# Altium project Fotokite.PrjPcb
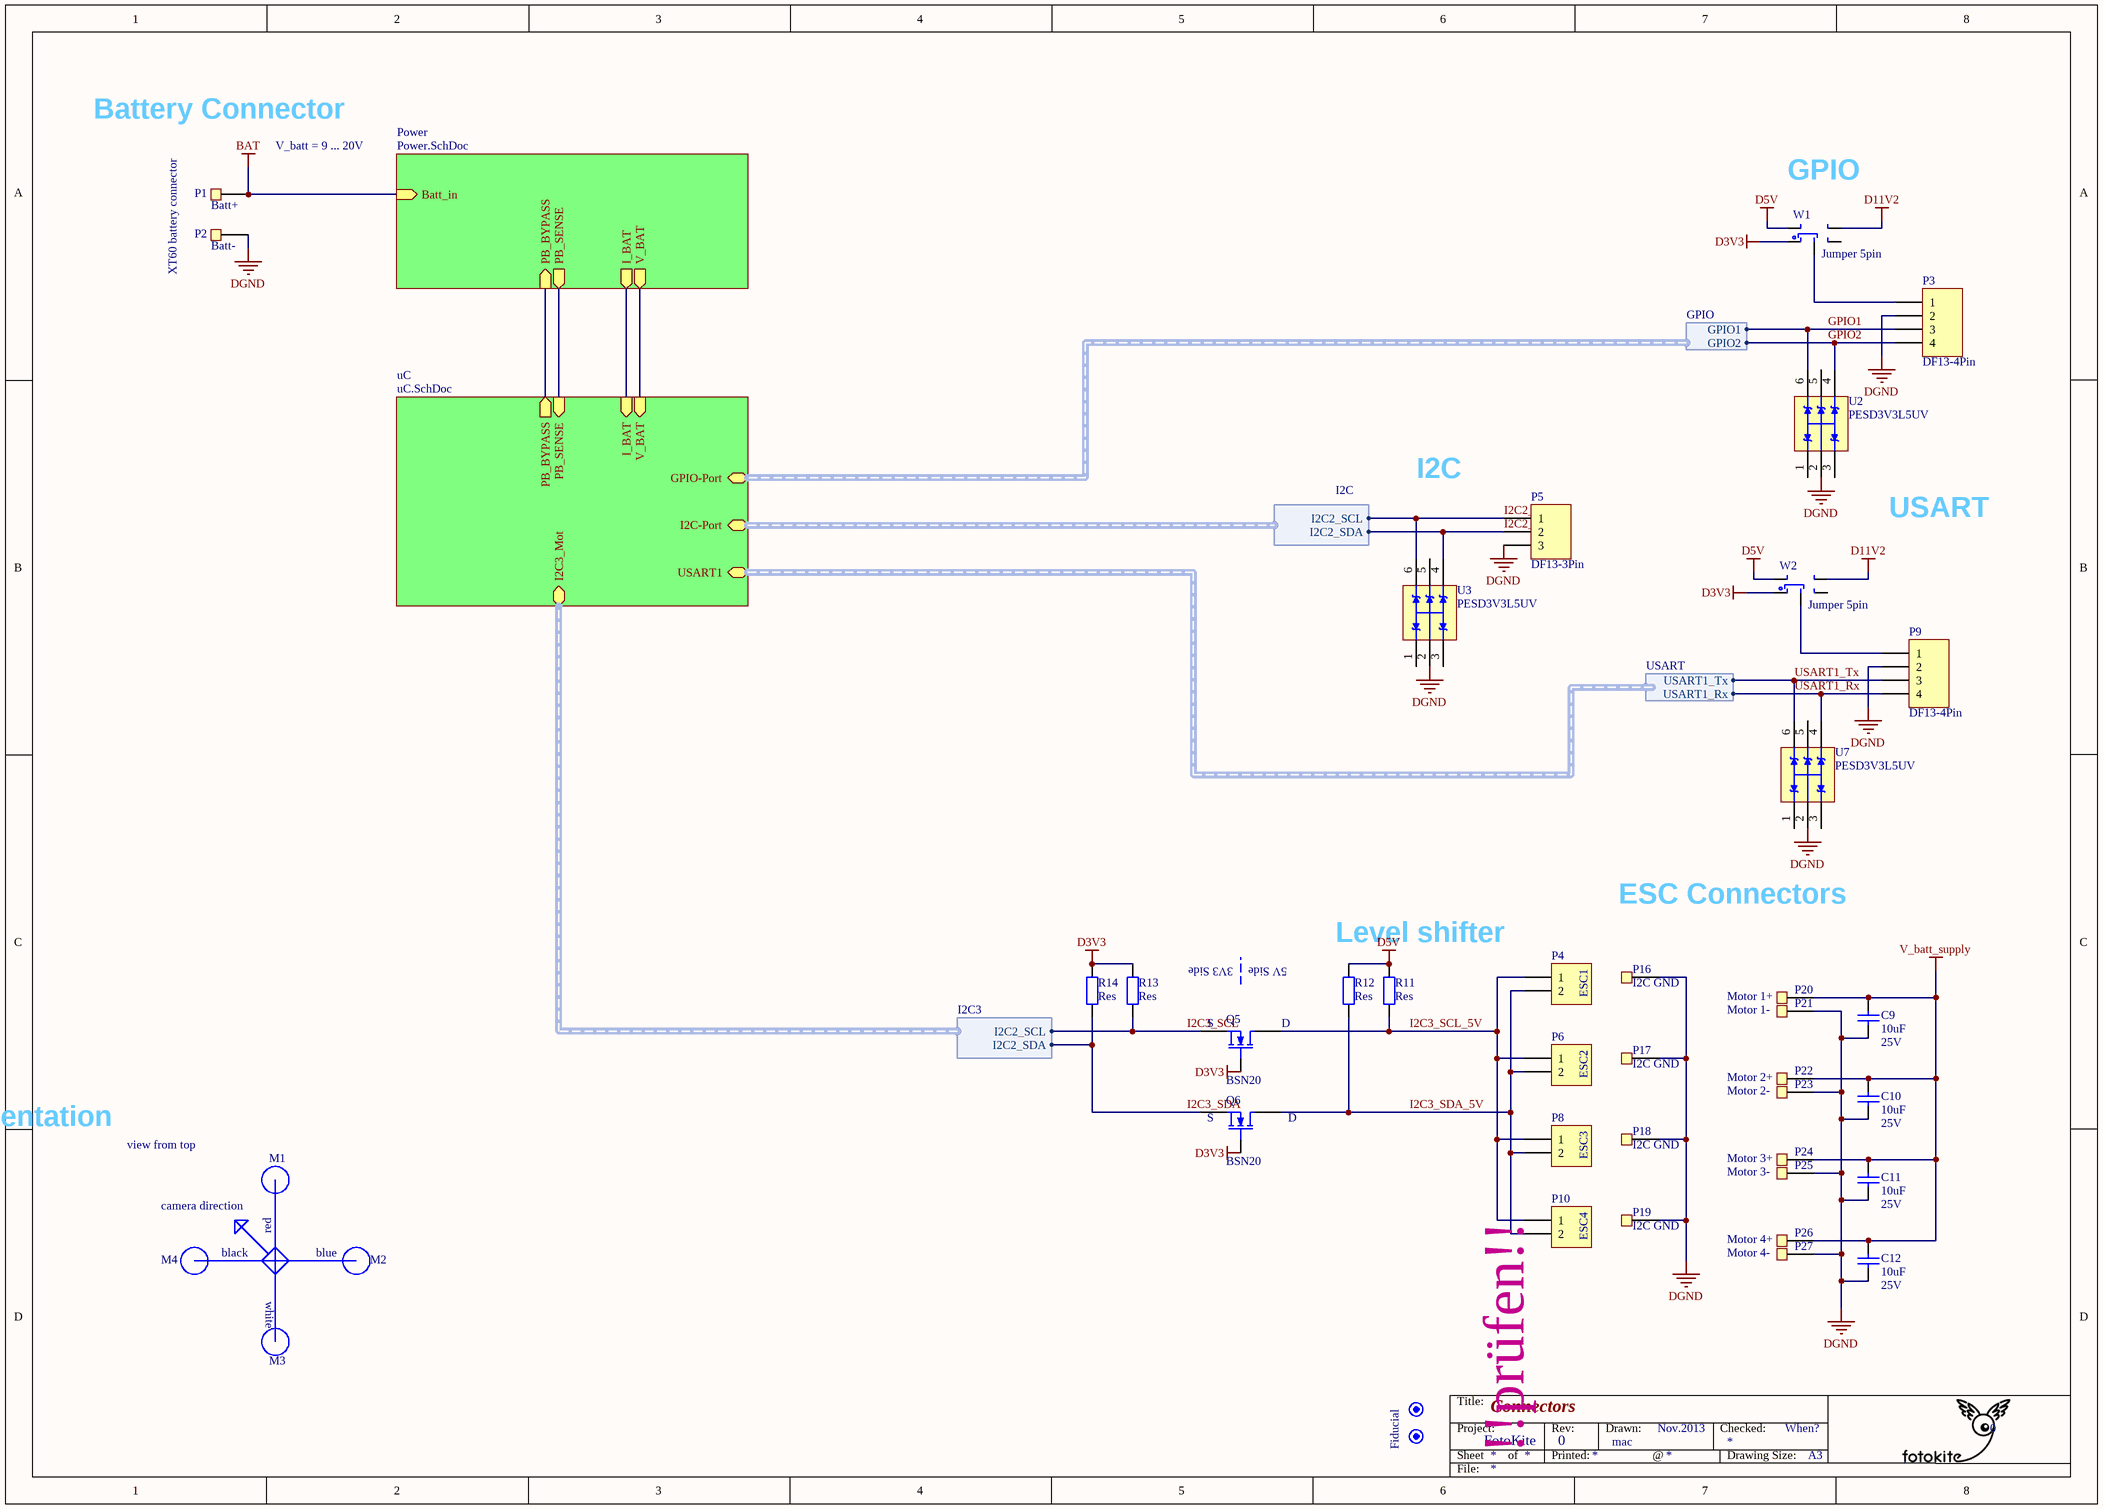
[diagram p0: Connector.SchDoc]
4 sheets, 128 parts. Net scope: hierarchical (ports join the sheet entries above them; power ports are global).
Board file: FotoKiteAdapter.PcbDoc
Sheets:
  Connector.SchDoc
    Power = Power.SchDoc
    uC = uC.SchDoc
  Ovweview.SchDoc

## Sheet Connector.SchDoc: Connectors
size A3; DrawnBy: mac; Revision: 0; Project: FotoKite; DrwanWhen: Nov.2013; CheckedWhen: When?; ProjectName: Fotokite

### Parts
C9  10uF  Note: 25V  [CAP_0805i_2012m -N]
C10  10uF  Note: 25V  [CAP_0805i_2012m -N]
C11  10uF  Note: 25V  [CAP_0805i_2012m -N]
C12  10uF  Note: 25V  [CAP_0805i_2012m -N]
FID1  Fiducial  [Fiducial 2 sides]  (value not drawn)  (no BOM)
FID2  Fiducial  [Fiducial 2 sides]  (no BOM)
P1  Batt+  [Pad_3x6mm]
P2  Batt-  [Pad_3x6mm]
P3  DF13-4Pin  [Hirose_DF13_SMT_RA_N4]
P4  ESC1  [Hirose_DF13_SMT_RA_N2]
P5  DF13-3Pin  [Hirose_DF13_SMT_RA_N3]
P6  ESC2  [Hirose_DF13_SMT_RA_N2]
P8  ESC3  [Hirose_DF13_SMT_RA_N2]
P9  DF13-4Pin  [Hirose_DF13_SMT_RA_N4]
P10  ESC4  [Hirose_DF13_SMT_RA_N2]
P16  I2C GND  [Pad_0603]
P17  I2C GND  [Pad_0603]
P18  I2C GND  [Pad_0603]
P19  I2C GND  [Pad_0603]
P20  Motor 1+  [Pad_3x4.5mm]
P21  Motor 1-  [Pad_3x4.5mm]
P22  Motor 2+  [Pad_3x4.5mm]
P23  Motor 2-  [Pad_3x4.5mm]
P24  Motor 3+  [Pad_3x4.5mm]
P25  Motor 3-  [Pad_3x4.5mm]
P26  Motor 4+  [Pad_3x4.5mm]
P27  Motor 4-  [Pad_3x4.5mm]
Q5  BSN20  [SOT23-N]
Q6  BSN20  [SOT23-N]
R11  Res  [RES_0402i_1005m -N]
R12  Res  [RES_0402i_1005m -N]
R13  Res  [RES_0402i_1005m -N]
R14  Res  [RES_0402i_1005m -N]
U2  PESD3V3L5UV  [SOT-666-N]
U3  PESD3V3L5UV  [SOT-666-N]
U7  PESD3V3L5UV  [SOT-666-N]
W1  Jumper 5pin  [J5_solder xstyle]
W2  Jumper 5pin  [J5_solder xstyle]

### Sub-sheets
Power = Power.SchDoc: Batt_in (in), I_BAT (out), PB_BYPASS (in), PB_SENSE (out), V_BAT (out)
uC = uC.SchDoc: I_BAT (in), V_BAT (in), I2C3_Mot (harness I2C3), I2C-Port (harness I2C), GPIO-Port (harness GPIO), PB_SENSE (in), PB_BYPASS (out), USART1 (harness USART)

### Harnesses
I2C3: I2C2_SCL, I2C2_SDA
I2C: I2C2_SCL, I2C2_SDA
GPIO: GPIO1, GPIO2
USART: USART1_Tx, USART1_Rx

### Nets
BAT: P1.1 ; sheet Power/Batt_in
D3V3: Q5.1(G) Q6.1(G) R13.2 R14.2 W1.1(C1) W2.1(C1)
D5V: R11.2 R12.2 W1.4(C4) W2.4(C4)
D11V2: W1.3(C3) W2.3(C3)
DGND: C9.1 C10.1 C11.1 C12.1 P2.1 P3.2 P5.3 P9.2 P16.1 P17.1 P18.1 P19.1 P21.1 P23.1 P25.1 P27.1 U2.2(a) U3.2(a) U7.2(a)
V_batt_supply: C9.2 C10.2 C11.2 C12.2 P20.1 P22.1 P24.1 P26.1
GPIO1: P3.3 U2.6(c5) ; sheet uC/GPIO-Port.GPIO1
GPIO2: P3.4 U2.4(c3) ; sheet uC/GPIO-Port.GPIO2
I2C2_SCL: P5.1 U3.6(c5) ; sheet uC/I2C-Port.I2C2_SCL
I2C2_SDA: P5.2 U3.4(c3) ; sheet uC/I2C-Port.I2C2_SDA
I2C3_SCL: Q5.2(S) R13.1 ; sheet uC/I2C3_Mot.I2C2_SCL
I2C3_SCL_5V: P4.1 P6.1 P8.1 P10.1 Q5.3(D) R11.1
I2C3_SDA: Q6.2(S) R14.1 ; sheet uC/I2C3_Mot.I2C2_SDA
I2C3_SDA_5V: P4.2 P6.2 P8.2 P10.2 Q6.3(D) R12.1
I_BAT: sheet Power/I_BAT, sheet uC/I_BAT
PB_BYPASS: sheet Power/PB_BYPASS, sheet uC/PB_BYPASS
PB_SENSE: sheet Power/PB_SENSE, sheet uC/PB_SENSE
USART1_Rx: P9.3 P9.4 U7.4(c3) U7.6(c5) ; sheet uC/USART1.USART1_Tx, sheet uC/USART1.USART1_Rx  [also labelled USART1_Tx]
V_BAT: sheet Power/V_BAT, sheet uC/V_BAT
NetP3_1: P3.1 W1.5(C5)
NetP9_1: P9.1 W2.5(C5)

Not connected (* = marked no-connect by the designer): U2 1(c1) 3(c2) 5(c4); U3 1(c1) 3(c2) 5(c4); U7 1(c1) 3(c2) 5(c4); W1 2(C2); W2 2(C2)

### Notes on the sheet
- Battery Connector
- V_batt = 9 ... 20V
- (near W1) GPIO
- XT60 battery connector
- I2C
- USART
- ESC Connectors
- 3V3 Side
- 5V Side
- Level shifter
- (near Q5) S
- (near Q5) D
- Quadrocopter orientation
- (near Q6) S
- (near Q6) D
- view from top
- M1
- camera direction
- M4
- black
- red
- blue
- M2
- !!prüfen!!
- white
- M3
- 0
- Sheet
- Project:
- Title:
- of
- Rev:
- Printed:
- Drawn:
- @
- Checked:
- Drawing Size:
- A3
- File:

### Library data of the parts
C9-C12 = Cap: capacitor; Supplier: digi-key: 587-2985-1-ND
FID1 FID2 = Fiducial: Fiducial mark for automatic pcb population; note: there is a on layer and a two layer footprint!
P1 P2 = Pad: Single Pad or Testpoint
P3 P9 = DF13-4Pin: Hirose_DF13_SMT_RA_N4
P4 P6 P8 P10 = DF13-2Pin: Hirose_DF13_SMT_RA_N2; Manufacturer ID: Hirose: DF13A-2P-1.25H(50); Supplier: digikey: H3380-ND
P5 = DF13-3Pin: Hirose_DF13_SMT_RA_N4
P16-P27 = Pad: Single Pad or Testpoint; Note: kein Bauteil
Q5 Q6 = MOSFET-N: N-Channel MOSFET; Manufacturer ID: Diodes Inc: BSN20-7; Value: BSN20; Digi-Key Part No.: BSN20-7DICT-ND; Supplier: digikey: BSN20-7DICT-ND
R11-R14 = Res: Resistor
U2 U3 U7 = PESDx: ESD-protection diode array, 5ch; Manufacturer ID: NXP:  PESD3V3L5UV; Supplier: digi-key: 568-6750-2-ND
W1 W2 = Jumper 5pin: Jumper 5-pin style

## Sheet Power.SchDoc: Power Supplies
size A3; DrawnBy: MAC; Project: FotoKite; DrwanWhen: Nov.2013; CheckedWhen: When?
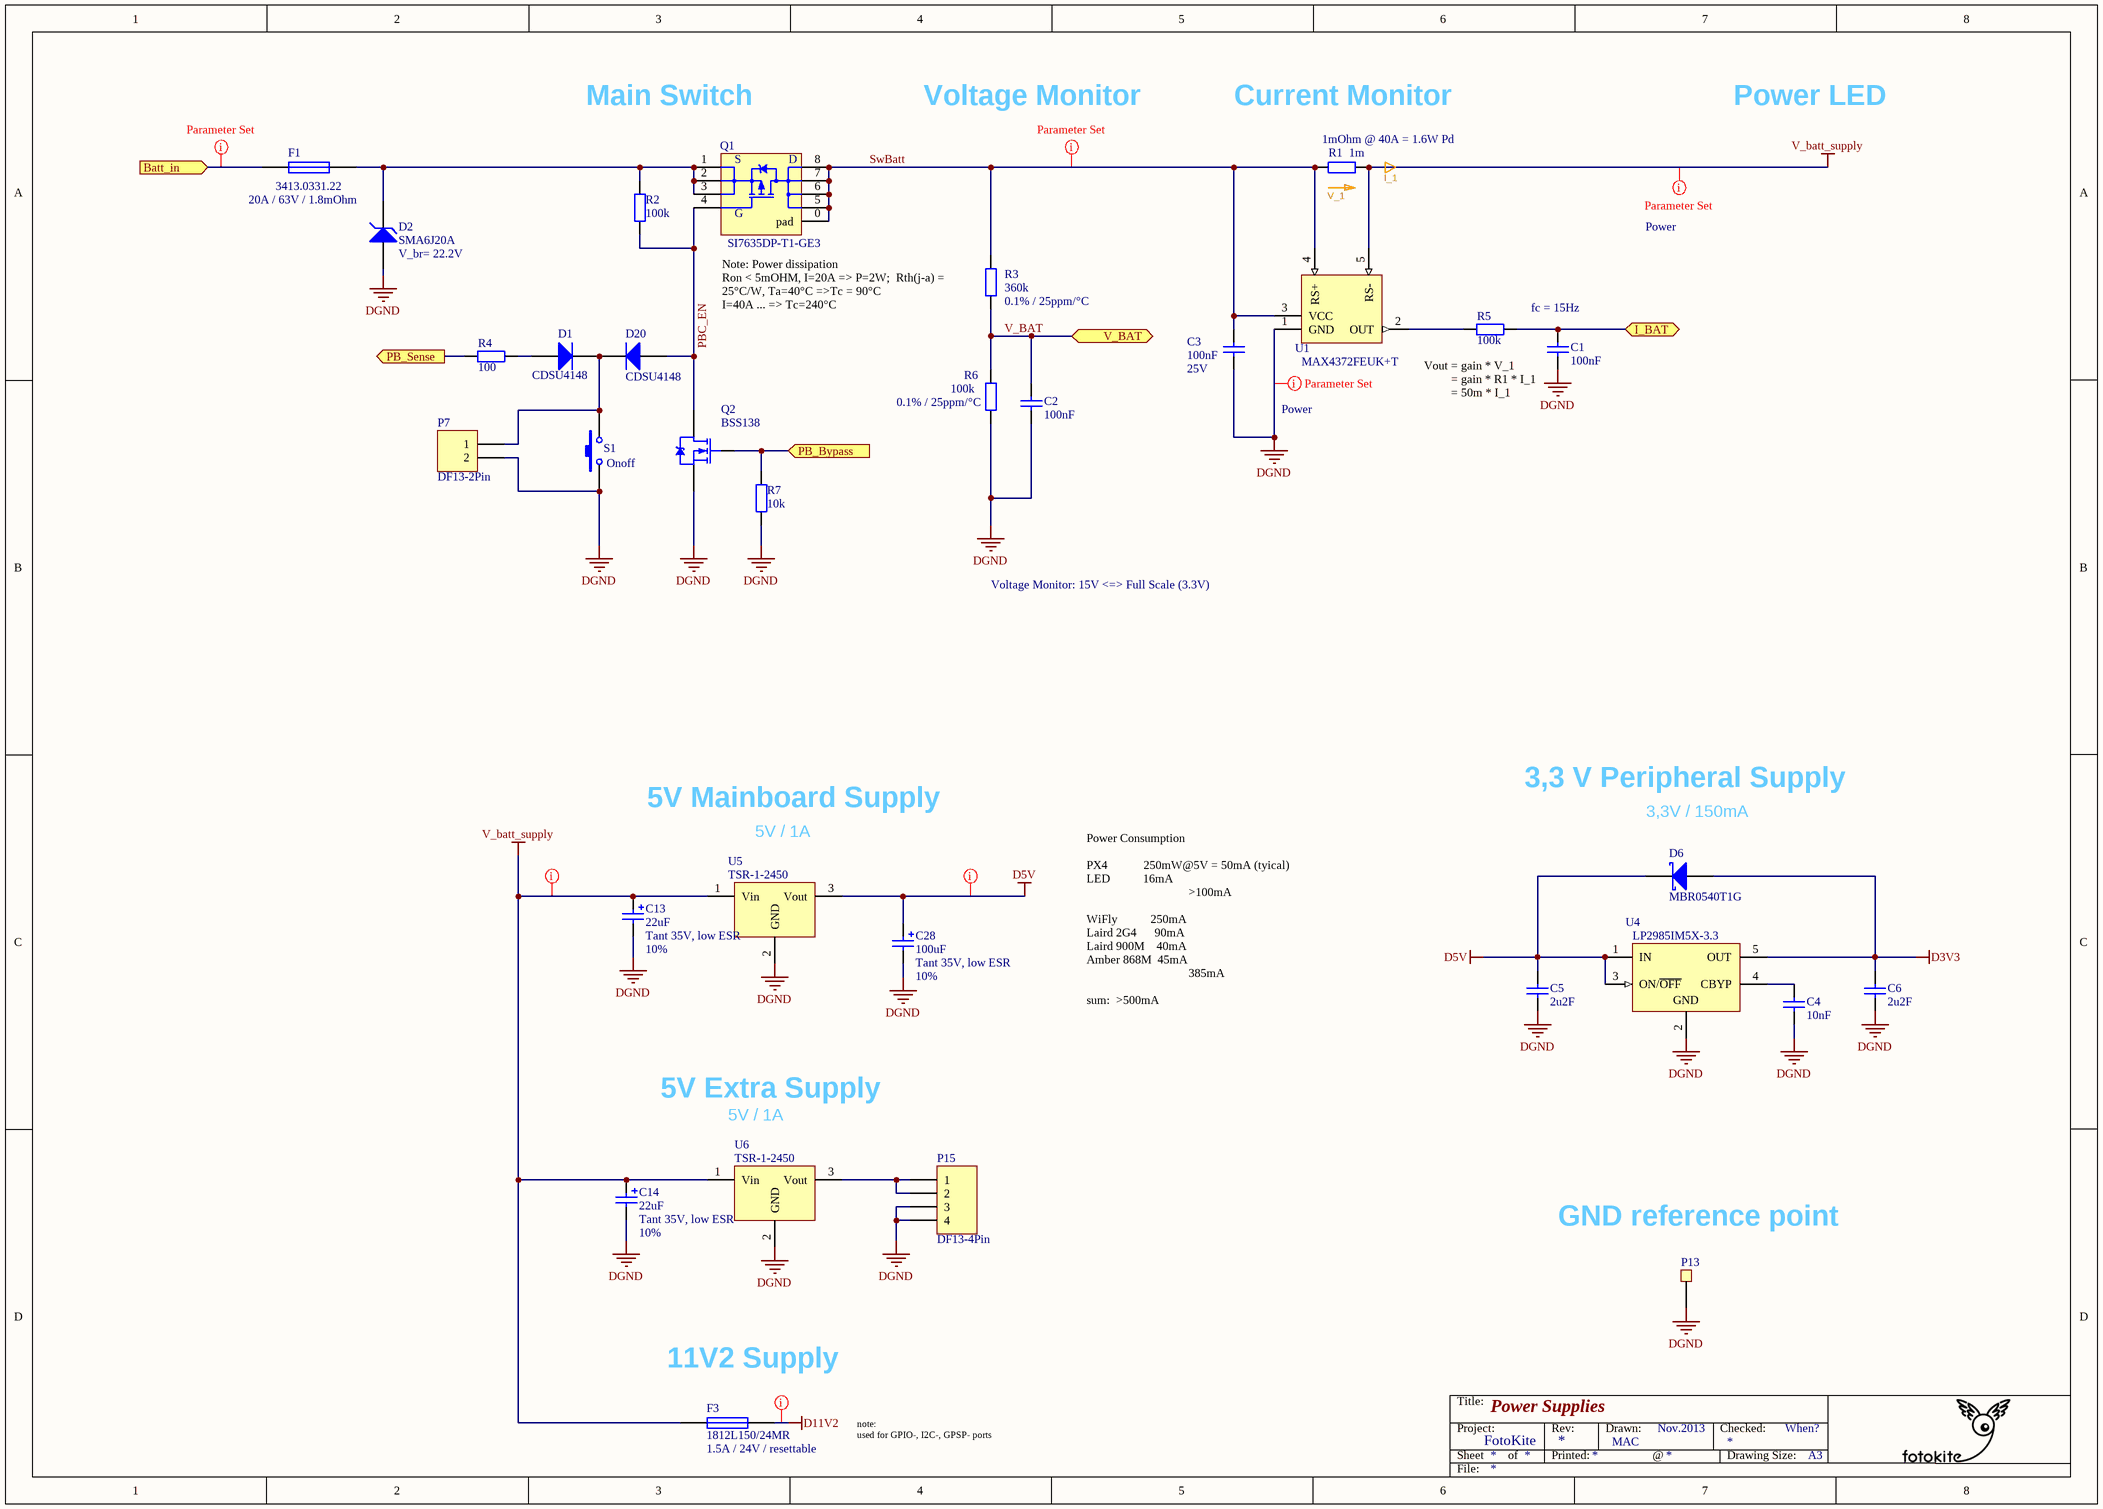
[diagram p1: Power.SchDoc]

### Parts
(Parts that share a designator on the sheet are numbered #1, #2 ... from top to bottom, then left to right.)
*#1  Note: I_1  (hidden comment: arrow_Current)  (graphical)
*#2  Note: V_1  (hidden comment: arrow_Voltage)  (graphical)
C1  100nF  [CAP_0603i_1608m -N]
C2  100nF  [CAP_0603i_1608m -N]
C3  100nF  Note: 25V  [CAP_0603i_1608m -N]
C4  10nF  [CAP_0603i_1608m -N]
C5  2u2F  [CAP_0603i_1608m -N]
C6  2u2F  [CAP_0603i_1608m -N]
C13  22uF  Note: Tant 35V, low ESR  Tolerance: 10%  [EIA-7343-31 case D -N]
C14  22uF  Note: Tant 35V, low ESR  Tolerance: 10%  [EIA-7343-31 case D -N]
C28  100uF  Note: Tant 35V, low ESR  Tolerance: 10%  [EIA-7343-31 case D -N]
D1  CDSU4148  [SOD523F]
D2  SMA6J20A  Note: V_br= 22.2V  [Mini MELF - SOD-80 -N]
D6  MBR0540T1G  [SOD123]
D20  CDSU4148  [SOD523F]
F1  3413.0331.22  Note: 20A / 63V / 1.8mOhm  [Fuse_1210i_3225m -N]
F3  1812L150/24MR  value 1.5A / 24V / resettable  [Fuse_1812i_4532m -N]
P7  DF13-2Pin  [Hirose_DF13_SMT_RA_N2]
P13  GND  [PIN1]  (value not drawn)
P15  DF13-4Pin  [Hirose_DF13_SMT_RA_N4]
Q1  SI7635DP-T1-GE3  [PowerPak SO-8]
Q2  BSS138  [SOT23-N]
R1  1m  [RES_2512i_6332m -N]
R2  100k  [RES_0603i_1608m -N]
R3  360k  Tolerance: 0.1% / 25ppm/°C  [RES_0603i_1608m -N]
R4  100  [RES_0603i_1608m -N]
R5  100k  [RES_0603i_1608m -N]
R6  100k  Tolerance: 0.1% / 25ppm/°C  [RES_0603i_1608m -N]
R7  10k  [RES_0603i_1608m -N]
S1  Note: Onoff  [EVQPU]  (hidden comment: EVQ-PUB02K)
U1  MAX4372FEUK+T  [MAXM-U5+1_N]
U4  LP2985IM5X-3.3  [MF05A_N]
U5  TSR-1-2450  [TST-1]
U6  TSR-1-2450  [TST-1]

### Ports
Batt_in (in), I_BAT, PB_Bypass, PB_Sense, V_BAT

### Nets
BAT: F1.1 ; port Batt_in
D3V3: C6.2 D6.1(A) U4.5(OUT)
D5V: C5.2 C28.1 D6.2(K) U4.1(IN) U4.3(ON/~{OFF}) U5.3(Vout)
D11V2: F3.2
DGND: C1.1 C2.1 C3.1 C4.1 C5.1 C6.1 C13.2 C14.2 C28.2 D2.1(A) P7.2 P13.1 P15.3 P15.4 Q2.2(S) R6.1 R7.1 S1.2 U1.1(GND) U4.2(GND) U5.2(GND) U6.2(GND)
V_batt_supply: C13.1 C14.1 F3.1 R1.2 U1.5(RS-) U5.1(Vin) U6.1(Vin)
I_BAT: C1.2 R5.2 ; port I_BAT
PB_BYPASS: Q2.1(G) R7.2 ; port PB_Bypass
PB_SENSE: R4.2 ; port PB_Sense
PBC_EN: D20.1(A) Q1.4(G) Q2.3(D) R2.1
SwBatt: C3.2 Q1.0(pad) Q1.5(D) Q1.6(D) Q1.7(D) Q1.8(D) R1.1 R3.2 U1.3(VCC) U1.4(RS+)
V_BAT: C2.2 R3.1 R6.2 ; port V_BAT
NetC4_2: C4.2 U4.4(CBYP)
NetD1_1: D1.1(A) R4.1
NetD1_2: D1.2(K) D20.2(K) P7.1 S1.1
NetD2_2: D2.2(K) F1.2 Q1.1(S) Q1.2(S) Q1.3(S) R2.2
NetP15_1: P15.1 P15.2 U6.3(Vout)
NetR5_1: R5.1 U1.2(OUT)

### Layout directives
net class Power: BAT, D5V, D11V2, DGND, V_batt_supply
rule Width Constraint [Pref Width = 25mil    Min Width = 10mil    Max Width = 200mil]; net class Power: SwBatt

### Notes on the sheet
- Main Switch
- Voltage Monitor
- Current Monitor
- Power LED
- 1mOhm @ 40A = 1.6W Pd
- Note: Power dissipation
  Ron < 5mOHM, I=20A => P=2W;  Rth(j-a) = 25°C/W, Ta=40°C =>Tc = 90°C
  I=40A ... => Tc=240°C
- fc = 15Hz
- (near C1) Vout = gain * V_1
  = gain * R1 * I_1
  = 50m * I_1
- Voltage Monitor: 15V <=> Full Scale (3.3V)
- 5V Mainboard Supply
- 5V / 1A
- 3,3 V Peripheral Supply
- 3,3V / 150mA
- Power Consumption
  PX4            250mW@5V = 50mA (tyical)
  LED           16mA
  >100mA
  WiFly           250mA
  Laird 2G4      90mA
  Laird 900M    40mA
  Amber 868M  45mA
  385mA
  sum:  >500mA
- 5V Extra Supply
- (near P13) GND reference point
- (near F3) 11V2 Supply
- note:
  used for GPIO-, I2C-, GPSP- ports
- Sheet
- Project:
- Title:
- of
- Rev:
- Printed:
- Drawn:
- @
- Checked:
- Drawing Size:
- A3
- File:

### Library data of the parts
C1-C6 = Cap: capacitor
C13 C14 C28 = Cap pol: Polarised capacitor (e.g. Electrolytic )
D1 D20 = Diode: Default Diode; Supplier: digikey: 641-1001-1-ND
D2 = Diode Zener: Zener Diode; Manufacturer ID: STM: SMA6J20A-TR; Supplier: digi-key: 497-5925-1-ND
D6 = Diode  Schottky: Schottky Diode; Supplier: digi-key: MBR0540T1GOSCT-ND
F1 = Fuse: Manufacturer ID: Schurter: 3413.0331.22; Supplier: digi-key; 486-1689-1-ND
F3 = Fuse: Manufacturer ID: little fuse: 1812L150/24MR; Supplier: digi-key: F3487CT-ND
P7 = DF13-2Pin: Hirose_DF13_SMT_RA_N2
P13 = Pad: Single Pad or Testpoint
P15 = DF13-4Pin: Hirose_DF13_SMT_RA_N4
Q1 = MOSFET-P-Power_2: Power P-Channel MOSFET + pad; Note: Check footprint as it may  differ; Supplier: digikey: SI7635DP-T1-GE3CT-ND
Q2 = MOSFET-N2: N-Channel MOSFET; Note: Check footprint as it may  differ; Supplier: digikey: BSS138CT-ND
R1 = Res: Resistor; Tolerance: 1%/50ppm/°C; Supplier: Digikey: CSNL20.001FRCT-ND
R2 R4 R5 R7 = Res: Resistor
R3 = Res: Resistor; Note: digikey: A103088CT-ND
R6 = Res: Resistor; Note: digikey:RG16P100KBCT-ND
S1 = SW PB: Switch; Manufacturer ID: Panasonic: EVQ-PUB02K; Supplier: digi-key: P10848SCT-ND
U1 = CMP-0252-00304-1: Micropower, Voltage-Output, High-Side, Current-Sense Amplifier, 50 V / V Gain, -40 to 85 degC, 5-Pin SOT23 (U5+1), Pb-Free, Tape and Reel; Bi-Dir. Curr. Sense: No; Gain: 20 V/V, 50 V/V ,100 V/V; ComponentLink1Description: Manufacturer URL; ComponentLink3URL: http://pdfserv.maximintegrated.com/package_dwgs/21-0057.PDF; ComponentLink2URL: http://datasheets.maximintegrated.com/en/ds/MAX4372-MAX4372T.pdf; PackageDescription: 5-Pin Small-Outline Transistor Package (U5+1), Body 2.90 x 1.625 mm, Pitch 0.95 mm; Code_JEDEC: MO178; ComponentLink1URL: http://www.maximintegrated.com/; ComponentLink3Description: Package Specification; PackageVersion: Rev. G, 04/2011; DatasheetVersion: Rev. 5; PackageReference: U5+1; Mounting Technology: Surface Mount; PartNumber: MAX4372FEUK+T; ComponentLink2Description: Datasheet; supplier: digi-key: MAX4372FEUK+TCT-ND
U4 = CMP-0062-01952-2: Micropower 150 mA Low-Noise Ultra Low-Dropout Regulator, 5-pin SOT-23; Manufacturer: National Semiconductor; CompType: LDO IC; PackageTopMarking: L0RB*XTT; PowerWise: N; DatasheetVersion: Jul-2007; RoHS: N; ComponentLink2URL: http://www.national.com/pf/LP/LP2985.html; PackageReference: MF05A; PackageVersion: revD, Aug-2008; RevisionNote: Component URLs added; PinCount: 5; ComponentLink3Description: MF05A Package Page; PackageDescription: Molded SOT-23, .115 x .063 x .040 in Body, 5 Lead, .0375 in Pitch; ComponentLink2Description: LP2985 Web Page; ComponentLink1Description: LP2985 Datasheet; ComponentLink3URL: http://www.national.com/packaging/folders/mf05a.html; ComponentLink1URL: http://www.national.com/ds/LP/LP2985.pdf; supplier: digi-key: 296-18479-1-ND
U5 U6 = TSR-1-24xx: DC/DC Converter; different Voltages; 1A; Traco

## Sheet uC.SchDoc: uC
size A3; DrawnBy: MAC; Revision: 0; Project: FotoKite; DrwanWhen: Nov.2013; CheckedWhen: When?
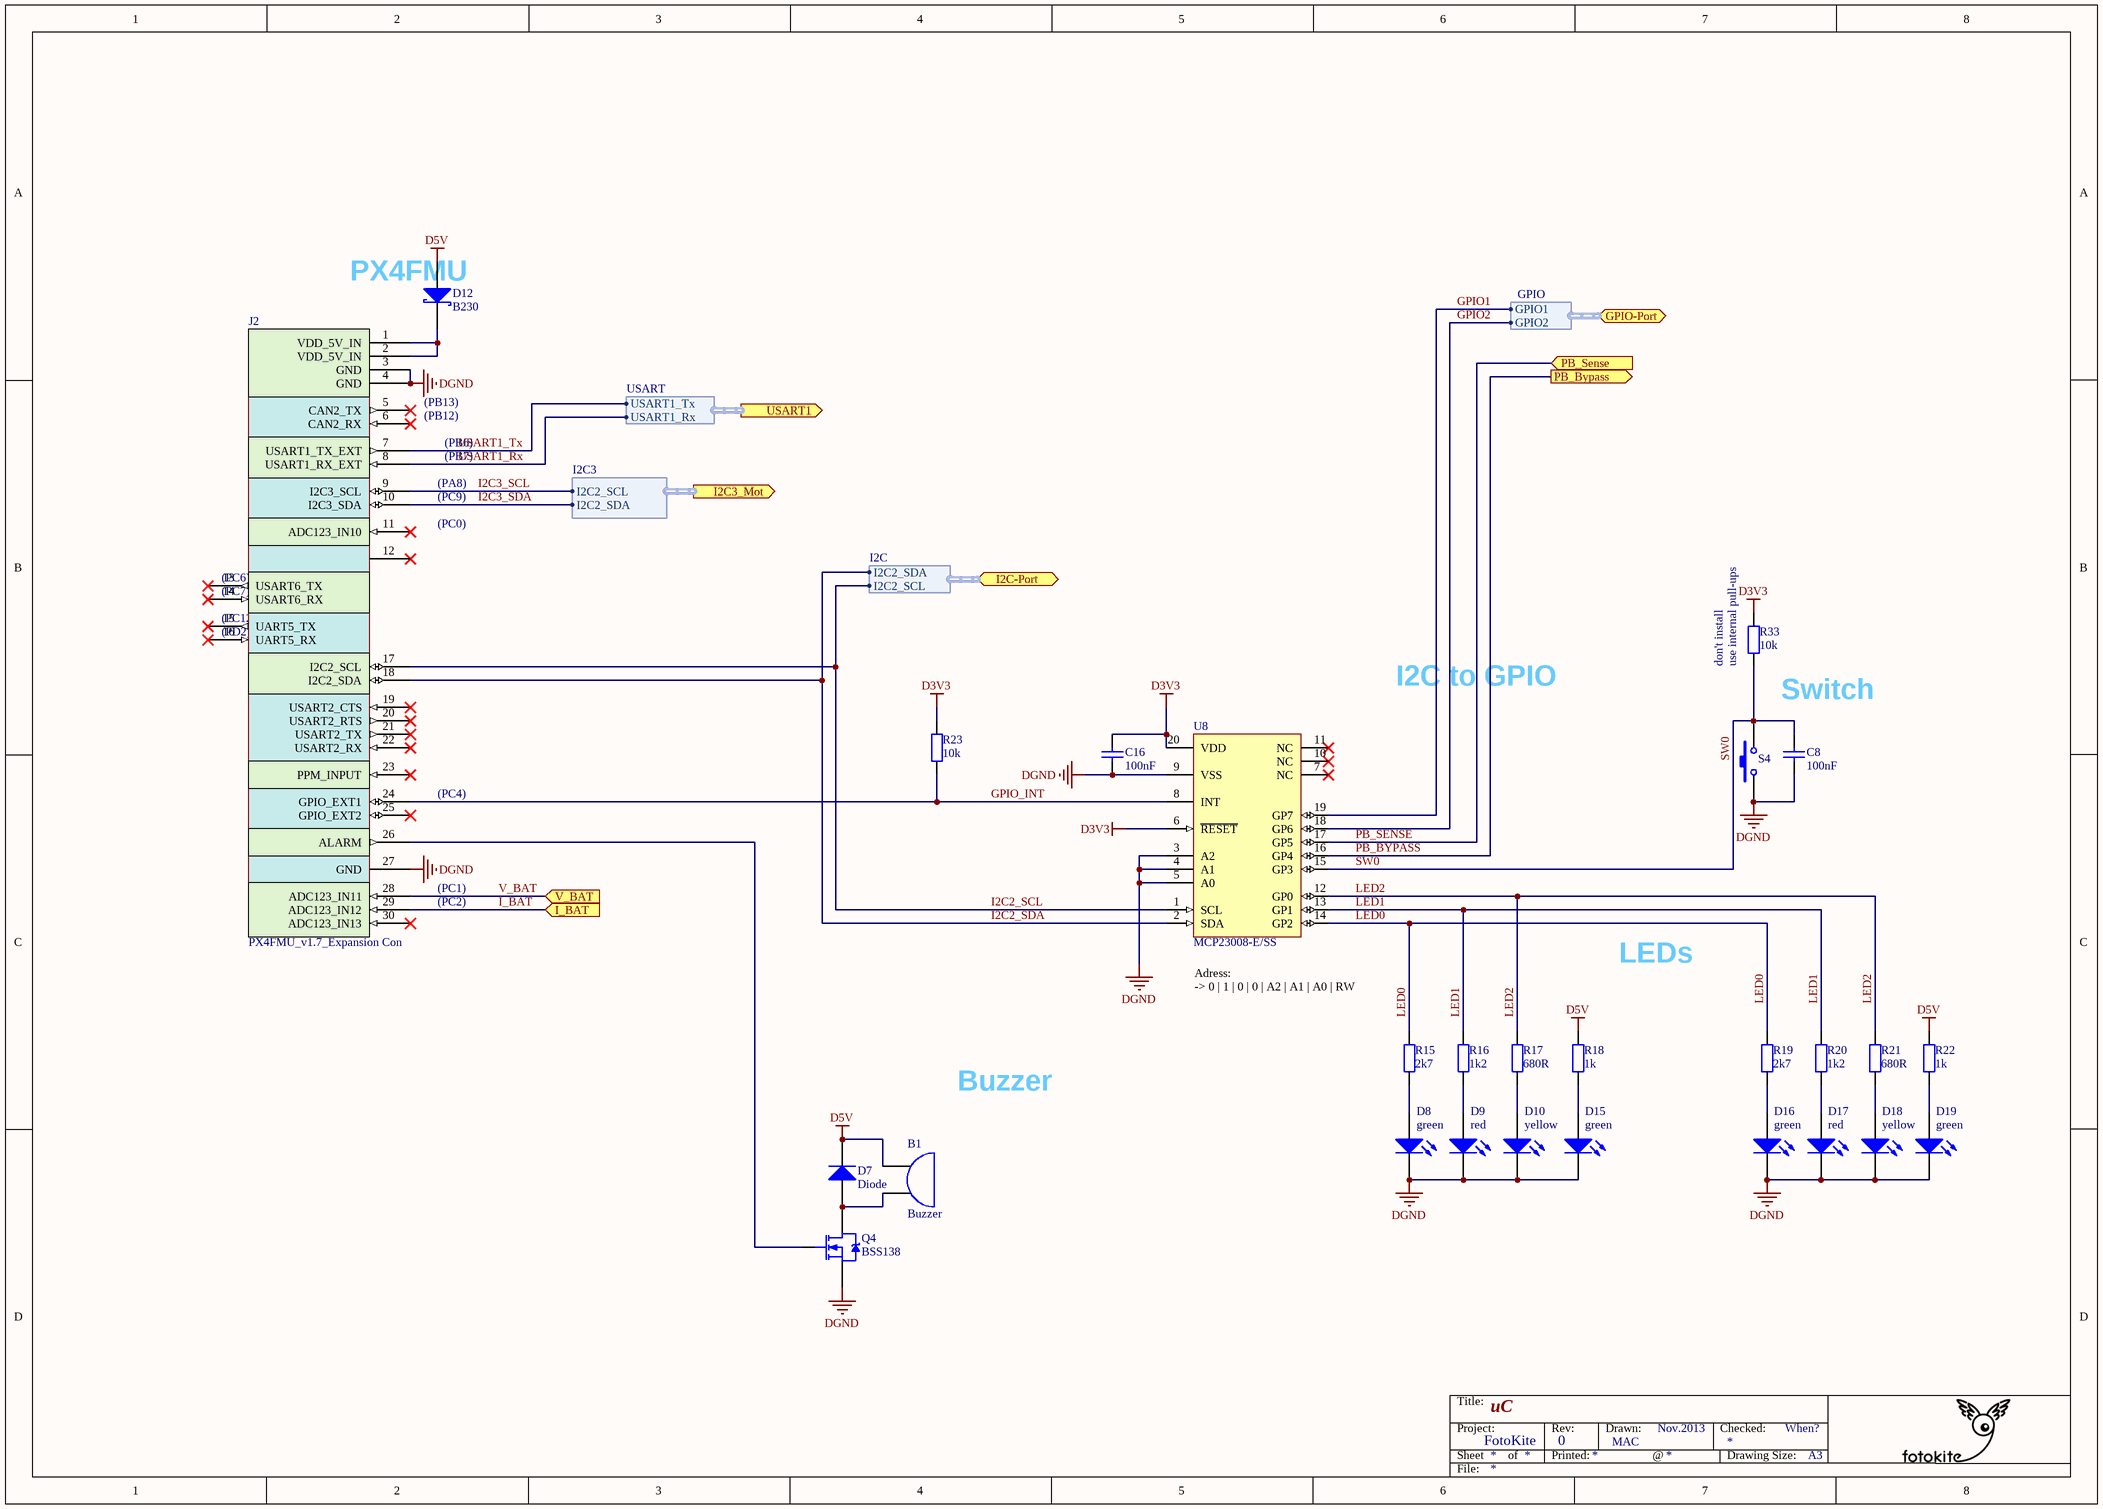
[diagram p2: uC.SchDoc]

### Parts
B1  Buzzer  [Buzzer_SMT-0827-SW-3V-R]
C8  100nF  [CAP_0603i_1608m -N]
C16  100nF  [CAP_0603i_1608m -N]
D7  Diode  [Mini MELF - SOD-80 -N]
D8  Colour: green  [LED_LTST_SIDE]  (hidden comment: Diode LED green)
D9  Colour: red  [LED_LTST_SIDE]  (hidden comment: Diode LED red)
D10  Colour: yellow  [LED_LTST_SIDE]  (hidden comment: Diode LED yellow)
D12  B230  [Diode SMB DO-214aa -N]
D15  Colour: green  [LED_LTST_SIDE]  (hidden comment: Diode LED green)
D16  Colour: green  [LED_LTST_SIDE]  (hidden comment: Diode LED green)
D17  Colour: red  [LED_LTST_SIDE]  (hidden comment: Diode LED red)
D18  Colour: yellow  [LED_LTST_SIDE]  (hidden comment: Diode LED yellow)
D19  Colour: green  [LED_LTST_SIDE]  (hidden comment: Diode LED green)
J2  PX4FMU_v1.7_Expansion Con  [PX4FMU_v1.7_module_sicket]
Q4  BSS138  [SOT23-N]
R15  2k7  [RES_0603i_1608m -N]
R16  1k2  [RES_0603i_1608m -N]
R17  680R  [RES_0603i_1608m -N]
R18  1k  [RES_0603i_1608m -N]
R19  2k7  [RES_0603i_1608m -N]
R20  1k2  [RES_0603i_1608m -N]
R21  680R  [RES_0603i_1608m -N]
R22  1k  [RES_0603i_1608m -N]
R23  10k  [RES_0603i_1608m -N]
R33  10k  Note: don't install  Note2: use internal pull-ups  [RES_0603i_1608m -N]
S4  EVQ-PUB02K  [EVQPU]  (value not drawn)
U8  MCP23008-E/SS  [SSOP-SS20_N]

### Ports
GPIO-Port (harness GPIO), I2C3_Mot (harness I2C3), I2C-Port (harness I2C), I_BAT (in), PB_Bypass (out), PB_Sense, USART1 (harness USART), V_BAT (in)

### Harnesses
I2C3: I2C2_SCL, I2C2_SDA
GPIO: GPIO1, GPIO2
I2C: I2C2_SCL, I2C2_SDA
USART: USART1_Tx, USART1_Rx

### Nets
D3V3: C16.1 R23.2 R33.2 U8.6(~{RESET}) U8.20(VDD)
D5V: B1.1 D7.2(K) D12.1(A) R18.2 R22.2
DGND: C8.1 C16.2 D8.2(K) D9.2(K) D10.2(K) D15.2(K) D16.2(K) D17.2(K) D18.2(K) D19.2(K) J2.3(GND) J2.4(GND) J2.27(GND) Q4.2(S) S4.2 U8.3(A2) U8.4(A1) U8.5(A0) U8.9(VSS)
GPIO1: U8.19(GP7) ; port GPIO-Port.GPIO1
GPIO2: U8.18(GP6) ; port GPIO-Port.GPIO2
GPIO_INT: J2.24(GPIO_EXT1) R23.1 U8.8(INT)
I2C2_SCL: J2.17(I2C2_SCL) U8.1(SCL) ; port I2C-Port.I2C2_SCL
I2C2_SDA: J2.18(I2C2_SDA) U8.2(SDA) ; port I2C-Port.I2C2_SDA
I2C3_SCL: J2.9(I2C3_SCL) ; port I2C3_Mot.I2C2_SCL
I2C3_SDA: J2.10(I2C3_SDA) ; port I2C3_Mot.I2C2_SDA
I_BAT: J2.29(ADC123_IN12) ; port I_BAT
LED0: R15.2 R19.2 U8.14(GP2)
LED1: R16.2 R20.2 U8.13(GP1)
LED2: R17.2 R21.2 U8.12(GP0)
PB_BYPASS: U8.16(GP4) ; port PB_Bypass
PB_SENSE: U8.17(GP5) ; port PB_Sense
SW0: C8.2 R33.1 S4.1 U8.15(GP3)
USART1_Rx: J2.7(USART1_TX_EXT) J2.8(USART1_RX_EXT) ; port USART1.USART1_Tx, port USART1.USART1_Rx  [also labelled USART1_Tx]
V_BAT: J2.28(ADC123_IN11) ; port V_BAT
NetB1_2: B1.2 D7.1(A) Q4.3(D)
NetD8_1: D8.1(A) R15.1
NetD9_1: D9.1(A) R16.1
NetD10_1: D10.1(A) R17.1
NetD12_2: D12.2(K) J2.1(VDD_5V_IN) J2.2(VDD_5V_IN)
NetD15_1: D15.1(A) R18.1
NetD16_1: D16.1(A) R19.1
NetD17_1: D17.1(A) R20.1
NetD18_1: D18.1(A) R21.1
NetD19_1: D19.1(A) R22.1
NetJ2_26: J2.26(ALARM) Q4.1(G)

Not connected (* = marked no-connect by the designer): J2 5(CAN2_TX)* 6(CAN2_RX)* 11(ADC123_IN10)* 12* 13(USART6_TX)* 14(USART6_RX)* 15(UART5_TX)* 16(UART5_RX)* 19(USART2_CTS)* 20(USART2_RTS)* 21(USART2_TX)* 22(USART2_RX)* 23(PPM_INPUT)* 25(GPIO_EXT2)* 30(ADC123_IN13)*; U8 7(NC)* 10(NC)* 11(NC)*

### Notes on the sheet
- PX4FMU
- (near J2) (PB13)
- (near J2) (PB12)
- (near J2) (PB6)
- (near J2) (PA8)
- (near J2) (PC9)
- (near J2) (PB7)
- (near J2) (PC6)
- (near J2) (PC0)
- (near J2) (PC7)
- (near J2) (PC12)
- (near J2) (PD2)
- I2C to GPIO
- Switch
- (near J2) (PC4)
- (near J2) (PC1)
- (near J2) (PC2)
- LEDs
- Adress:
  -> 0 | 1 | 0 | 0 | A2 | A1 | A0 | RW
- Buzzer
- Sheet
- Project:
- Title:
- of
- Rev:
- Printed:
- Drawn:
- @
- Checked:
- Drawing Size:
- A3
- File:

### Library data of the parts
B1 = Buzzer: Generic Buzzer; Manufacturer ID: SMT-0827-SW-3V-R; Supplier: digikey: 668-1193-1-ND
C8 C16 = Cap: capacitor
D7 = Diode: Default Diode
D8 D15 D16 D19 = Diode LED: LED; Note: 1V7 / 2mA; Supplier: Digikey: 160-1478-1-ND
D9 D17 = Diode LED: LED; note: 1V8 / 2mA; Supplier: Digikey: 160-1479-1-ND
D10 D18 = Diode LED: LED; Note: 1V8 / 2mA; Supplier: Digikey: 160-1480-1-ND
D12 = Diode  Schottky: Schottky Diode; Manufacturer ID: Diodes Inc: B230-13-F; Note: Alternative: SS24/1; Supplier: digi-key: B230-FDICT-ND
J2 = PX4FMU_v1.7_Expansion Con_1: J2 / J3; Supplier: digikey: 3M9197CT-ND
Q4 = MOSFET-N2: as Q2 on sheet Power; Supplier: digikey: BSS138-FDICT-ND; price (1) €: 0.29; price (100) €: 0.1469
R15-R23 R33 = Res: Resistor
S4 = SW PB: as S1 on sheet Power; Supplier: digi-key: P10848SCT-ND
U8 = CMP-0186-00169-3: 8-Bit I/O Expander with Serial Interface, 20-Pin SSOP, Extended Temperature; PackageVersion: revBB, Aug-2009; Code_JEDEC: MO-150; ComponentLink3URL: http://www.microchip.com/stellent/groups/techpub_sg/documents/packagingspec/en012702.pdf; PackageReference: SSOP-SS20; ComponentLink2Description: Datasheet; ComponentLink1URL: http://www.microchip.com/; ComponentLink2URL: http://ww1.microchip.com/downloads/en/DeviceDoc/21919e.pdf; RevisionNote: Sch corrected.; PackageDescription: 20-Lead Plastic Shrink Small Outline (SS) - 5.3mm Body [SSOP]; ComponentLink1Description: Manufacturer URL; ComponentLink3Description: Package Specification; DatasheetVersion: revE, Aug-2007

## Sheet Ovweview.SchDoc
size A3; Project: Project?; DrwanWhen: When?; CheckedWhen: When?
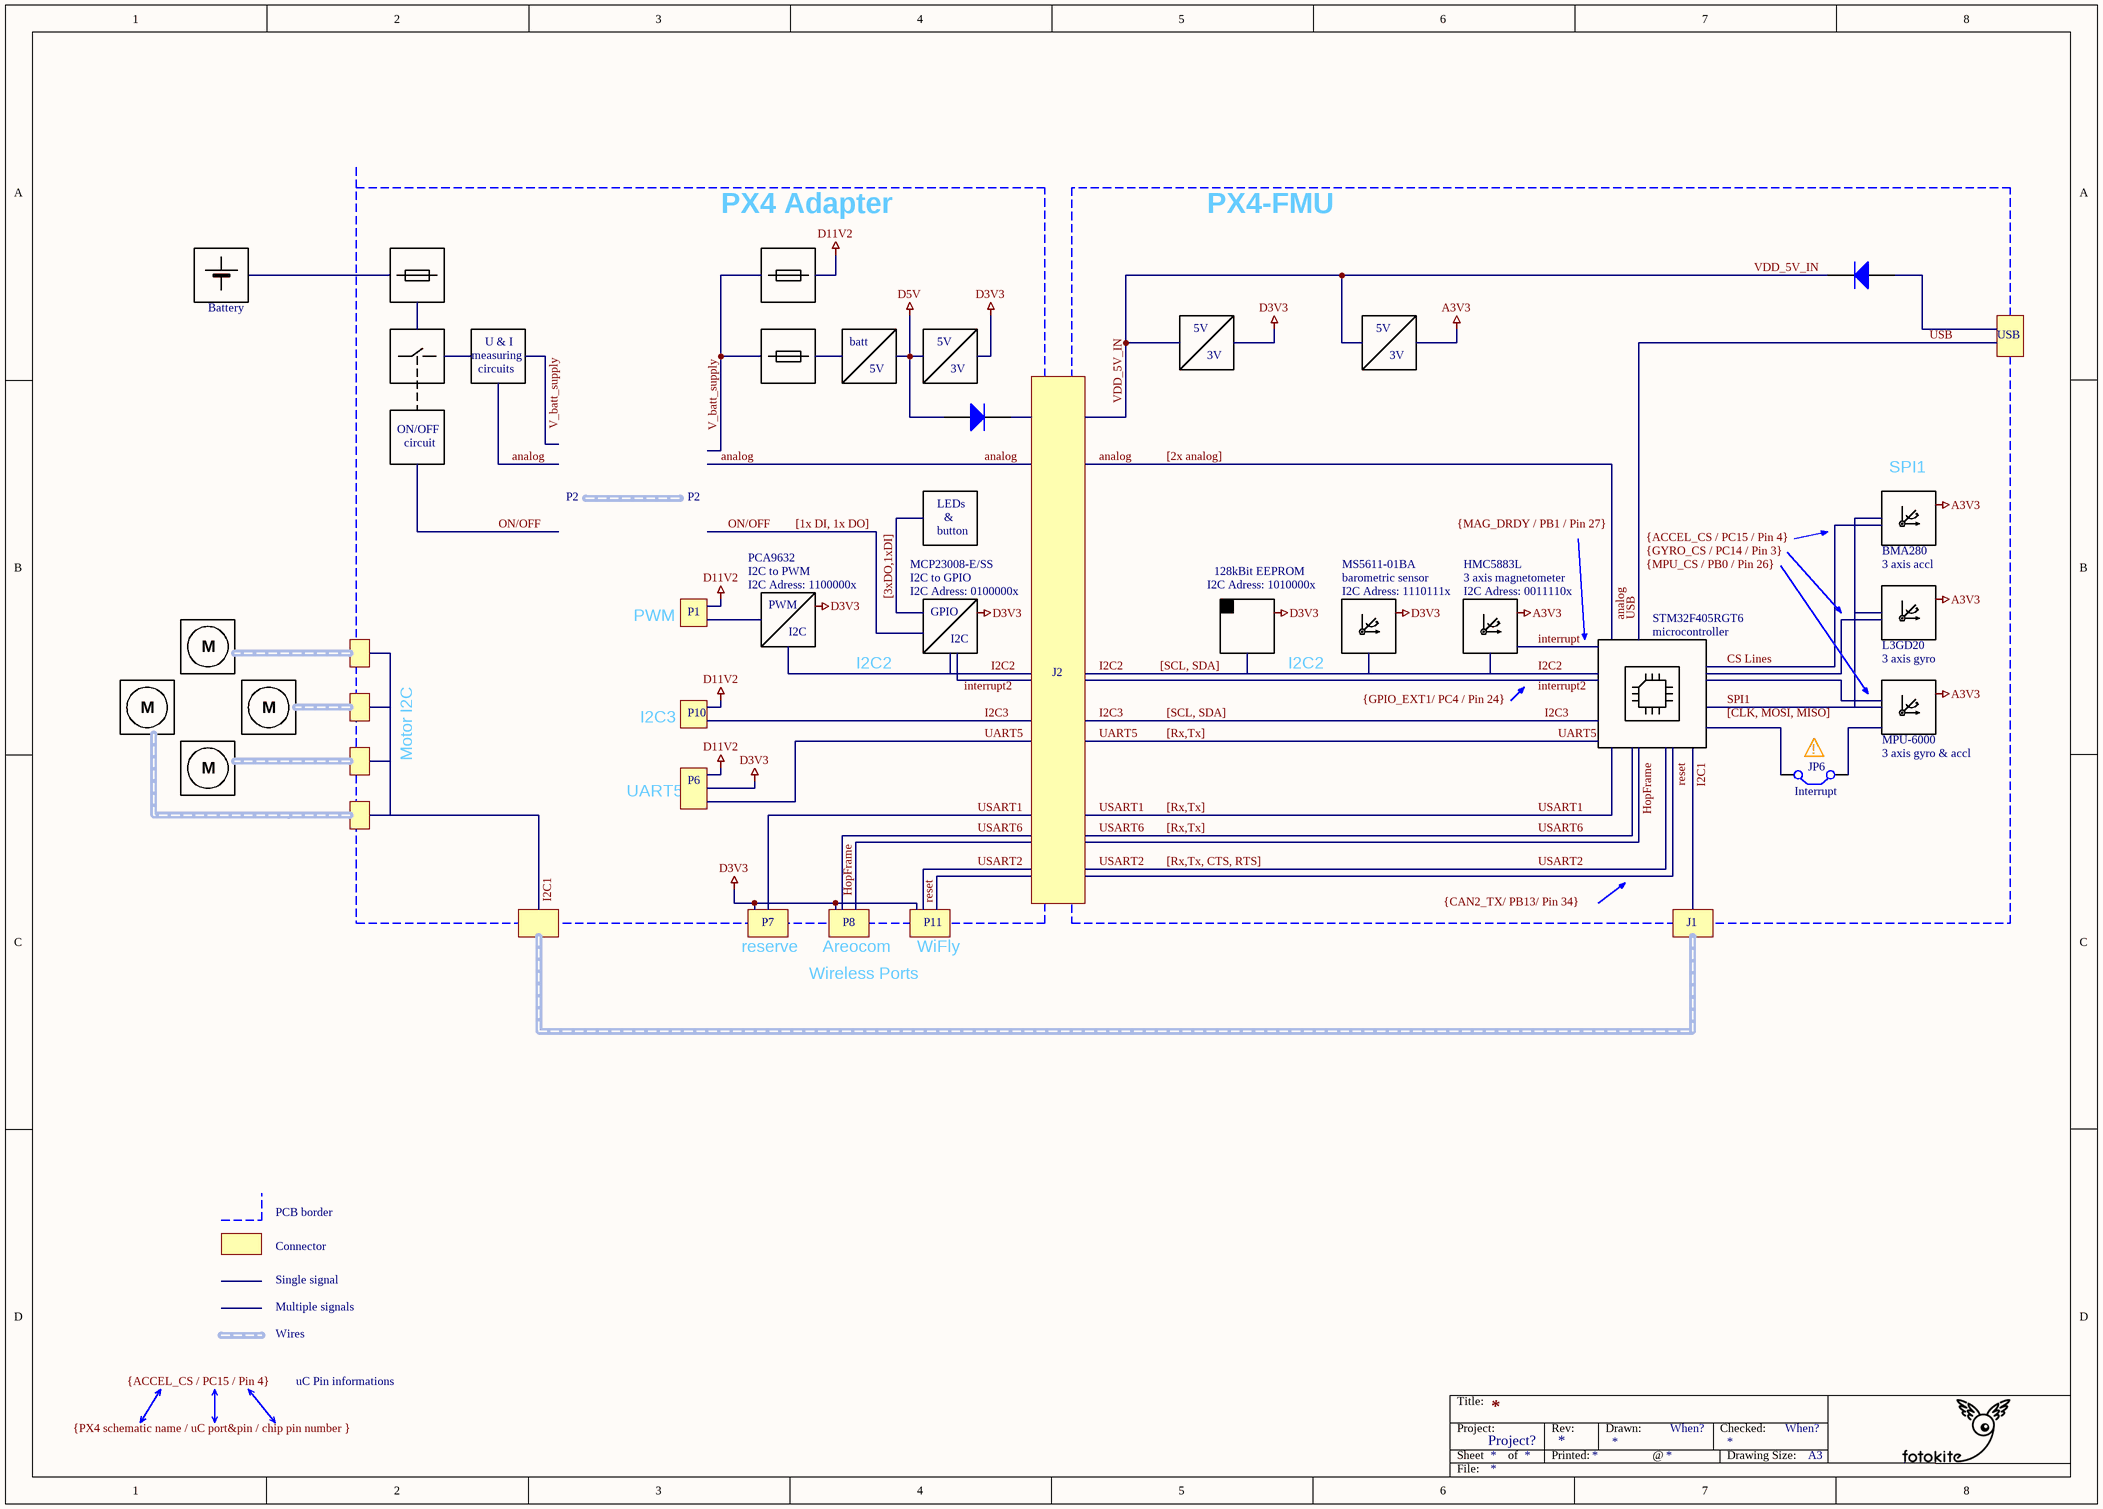
[diagram p3: Ovweview.SchDoc]

### Parts
(Parts that share a designator on the sheet are numbered #1, #2 ... from top to bottom, then left to right.)
128kBit_EEPROM  I2C Adress: 1010000x  (hidden comment: block_empty)  (graphical)
*#3  block_Fuse  (value not drawn)  (graphical)
*#4  block_Fuse  (value not drawn)  (graphical)
*#5  block_Transformer  (value not drawn)  (graphical)
*#6  block_Transformer  (value not drawn)  (graphical)
*#7  block_switch  (value not drawn)  (graphical)
*#8  Note: U & I  (hidden comment: block_empty)  (graphical)
*#9  block_Fuse  (value not drawn)  (graphical)
*#10  block_Transformer  (value not drawn)  (graphical)
*#11  block_Transformer  (value not drawn)  (graphical)
*#12  block_empty  (value not drawn)  (graphical)
*#13  block_empty  (value not drawn)  (graphical)
*#14  block_motor  (value not drawn)  (graphical)
*#15  block_motor  (value not drawn)  (graphical)
*#16  block_motor  (value not drawn)  (graphical)
*#17  sign_attention  (value not drawn)  (graphical)
*#18  block_motor  (value not drawn)  (graphical)
Battery  block_battery  (value not drawn)  (graphical)
BMA280  Note: 3 axis accl  (hidden comment: block_IMU)  (graphical)
D13  Diode  [Mini MELF - SOD-80 -N]  (value not drawn)
D14  Diode  [Mini MELF - SOD-80 -N]  (value not drawn)
HMC5883L  Note: 3 axis magnetometer  I2C Adress: 0011110x  (hidden comment: block_IMU)  (graphical)
JP6  Interrupt  [RES_0603i_1608m -N]
L3GD20  Note: 3 axis gyro  (hidden comment: block_IMU)  (graphical)
MCP23008-E/SS  Note: I2C to GPIO  I2C Adress: 0100000x  (hidden comment: block_Transformer)  (graphical)
MPU-6000  Note: 3 axis gyro & accl  (hidden comment: block_IMU)  (graphical)
MS5611-01BA  Note: barometric sensor  I2C Adress: 1110111x  (hidden comment: block_IMU)  (graphical)
PCA9632  Note: I2C to PWM  I2C Adress: 1100000x  (hidden comment: block_Transformer)  (graphical)
STM32F405RGT6  Note: microcontroller  (hidden comment: block_uC)  (graphical)

### Blocks framed on the sheet
PX4-FMU: 128kBit_EEPROM *#5 *#6 *#17 BMA280 D13 HMC5883L JP6 L3GD20 MPU-6000 MS5611-01BA STM32F405RGT6

### Nets
D5V: D14.1(A)
VDD_5V_IN: D13.2(K)

Not connected (* = marked no-connect by the designer): D13 1(A); D14 2(K); JP6 1(C1) 2(C2)

### Buses and harness runs
bus [1x DI, 1x DO] = ON/OFF
bus [2x analog] = analog
bus [3xDO,1xDI]
bus [Rx,Tx, CTS, RTS] = USART2
bus [Rx,Tx] = UART5
bus [Rx,Tx] = USART1
bus [Rx,Tx] = USART6
bus [SCL, SDA] = I2C2
bus [SCL, SDA] = I2C3
bus analog
bus I2C1
bus ON/OFF
bus SPI1
bus USB

### Notes on the sheet
- PX4 Adapter
- USB
- P2
- SPI1
- PWM
- P1
- I2C3
- P10
- (near MCP23008-E/SS) I2C2
- J2
- (near MS5611-01BA) I2C2
- Motor I2C
- P6
- UART5
- reserve
- P7
- Wireless Ports
- Areocom
- P8
- WiFly
- P11
- J1
- Connector
- PCB border
- Single signal
- Multiple signals
- Wires
- uC Pin informations
- Labels drawn without touching a wire or pin: [CLK, MOSI, MISO], A3V3, D3V3, interrupt2, {ACCEL_CS / PC15 / Pin 4}, {CAN2_TX/ PB13/ Pin 34}, {GPIO_EXT1/ PC4 / Pin 24}, {GYRO_CS / PC14 / Pin 3}, {MAG_DRDY / PB1 / Pin 27}, {MPU_CS / PB0 / Pin 26}, {PX4 schematic name / uC port&pin / chip pin number }
- Sheet
- Project:
- Title:
- of
- Rev:
- Printed:
- Drawn:
- @
- Checked:
- Drawing Size:
- A3
- File:
- (in symbol block_empty) LEDs; &; button; ON/OFF; circuit; measuring; circuits
- (in symbol block_motor) M
- (in symbol block_Transformer) PWM; I2C; GPIO; batt; 5V; 3V
- (in symbol sign_attention) !

### Library data of the parts
*#5 *#6 *#10 *#11 MCP23008-E/SS PCA9632 = block_Transformer: general Transformer
  *#5 *#6 *#10 *#11: Note: *
D13 D14 = Diode: Default Diode
JP6 = Jumper: Jumper Wire
128kBit_EEPROM *#8 *#12 *#13 = block_empty
  128kBit_EEPROM *#12 *#13: Note: *
*#3 *#4 *#9 = block_Fuse: Note: *
*#7 = block_switch: Note: *
*#14-*#16 *#18 = block_motor: Note: *
Battery = block_battery: Note: *

## Nets that join several sheets
BAT: Connector (P1.1), Power (F1.1)
D3V3: Connector (6 pins), Power (C6.2 D6.1 U4.5), uC (5 pins)
D5V: Connector (R11.2 R12.2 W1.4 W2.4), Power (6 pins), uC (5 pins), Ovweview (D14.1)
D11V2: Connector (W1.3 W2.3), Power (F3.2)
DGND: Connector (19 pins), Power (22 pins), uC (19 pins)
V_batt_supply: Connector (8 pins), Power (7 pins)
GPIO1: Connector (P3.3 U2.6), uC (U8.19)
GPIO2: Connector (P3.4 U2.4), uC (U8.18)
I2C2_SCL: Connector (P5.1 U3.6), uC (J2.17 U8.1)
I2C2_SDA: Connector (P5.2 U3.4), uC (J2.18 U8.2)
I2C3_SCL: Connector (Q5.2 R13.1), uC (J2.9)
I2C3_SDA: Connector (Q6.2 R14.1), uC (J2.10)
I_BAT: Power (C1.2 R5.2), uC (J2.29)
PB_BYPASS: Power (Q2.1 R7.2), uC (U8.16)
PB_SENSE: Power (R4.2), uC (U8.17)
USART1_Rx: Connector (P9.3 P9.4 U7.4 U7.6), uC (J2.7 J2.8)
V_BAT: Power (C2.2 R3.1 R6.2), uC (J2.28)